# Altium schematic sheet 接口.SchDoc
size A4
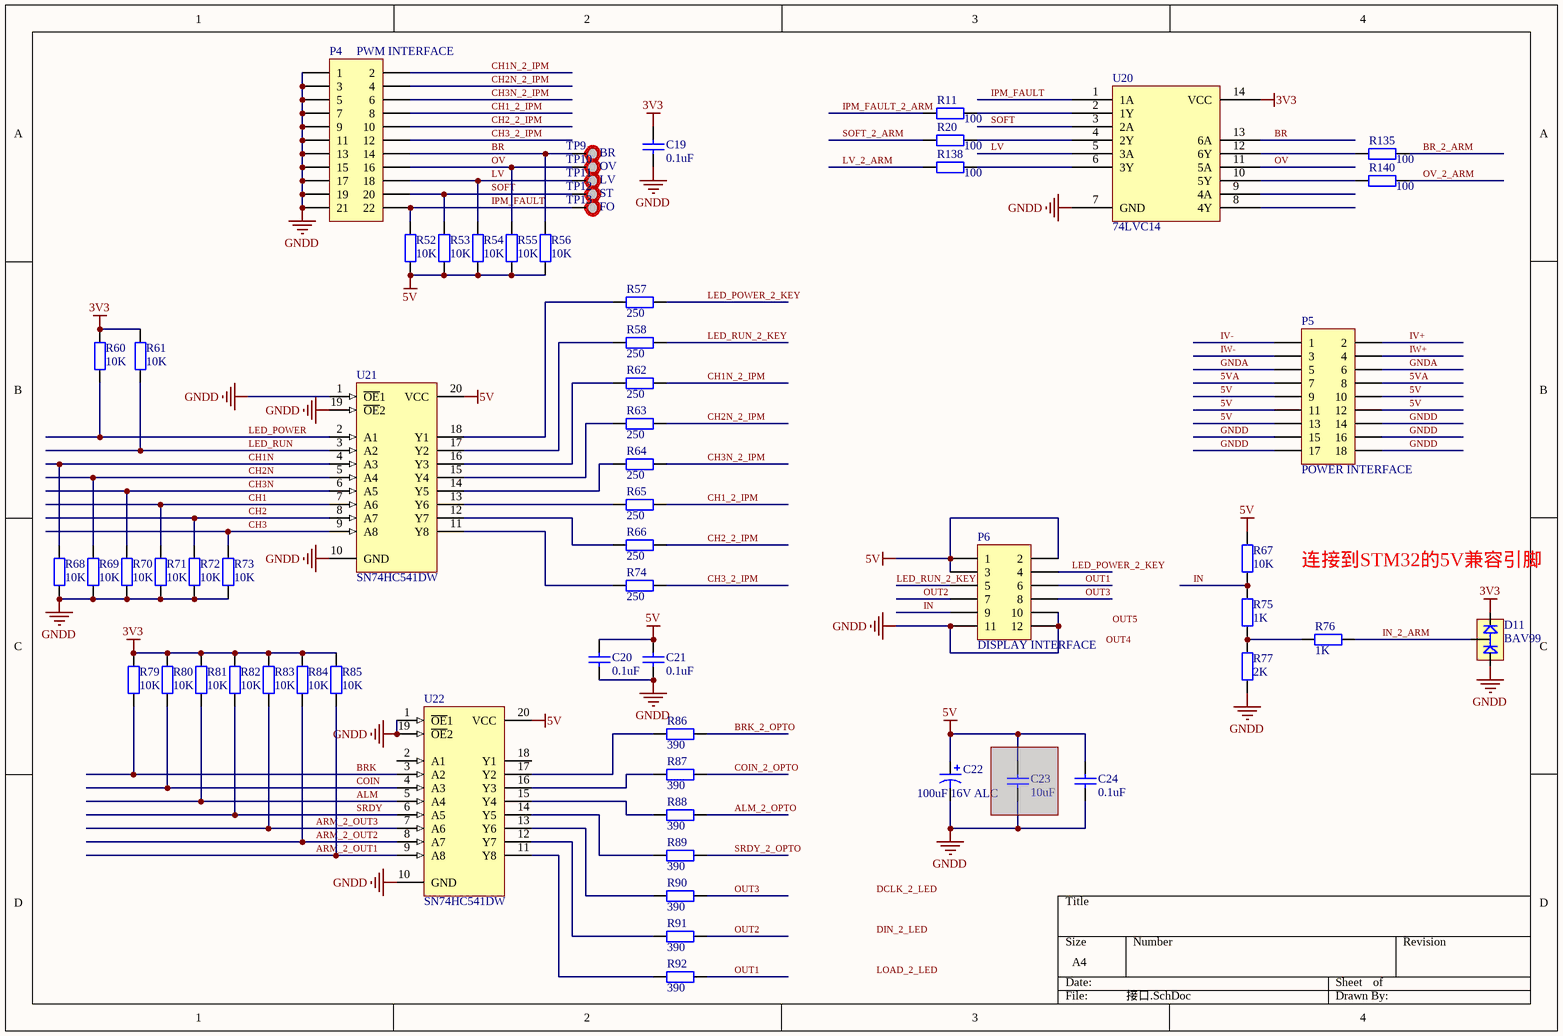
[diagram p0: 接口.SchDoc]

## Parts
C19  0.1uF  [C SMD 0603]
C20  0.1uF  [C SMD 0603]
C21  0.1uF  [C SMD 0603]
C22  100uF 16V ALC  [D6.3ALC]
C23  10uF  [C SMD 1206]  (masked out: inside a compile mask, not in the netlist)
C24  0.1uF  [C SMD 0603]
D11  BAV99  [SOT23]
P4  PWM INTERFACE  [FFC_1.0mm_22pin_弯]
P5  POWER INTERFACE  [FFC_1.0mm_18pin_弯]
P6  DISPLAY INTERFACE  [FFC_1.0mm_12pin_弯]
R11  100  [R SMD 0603]
R20  100  [R SMD 0603]
R52  10K  [R SMD 0603]
R53  10K  [R SMD 0603]
R54  10K  [R SMD 0603]
R55  10K  [R SMD 0603]
R56  10K  [R SMD 0603]
R57  250  [R SMD 0603]
R58  250  [R SMD 0603]
R60  10K  [R SMD 0603]
R61  10K  [R SMD 0603]
R62  250  [R SMD 0603]
R63  250  [R SMD 0603]
R64  250  [R SMD 0603]
R65  250  [R SMD 0603]
R66  250  [R SMD 0603]
R67  10K  [R SMD 0603]
R68  10K  [R SMD 0603]
R69  10K  [R SMD 0603]
R70  10K  [R SMD 0603]
R71  10K  [R SMD 0603]
R72  10K  [R SMD 0603]
R73  10K  [R SMD 0603]
R74  250  [R SMD 0603]
R75  1K  [R SMD 0603]
R76  1K  [R SMD 0603]
R77  2K  [R SMD 0603]
R79  10K  [R SMD 0603]
R80  10K  [R SMD 0603]
R81  10K  [R SMD 0603]
R82  10K  [R SMD 0603]
R83  10K  [R SMD 0603]
R84  10K  [R SMD 0603]
R85  10K  [R SMD 0603]
R86  390  [R SMD 0603]
R87  390  [R SMD 0603]
R88  390  [R SMD 0603]
R89  390  [R SMD 0603]
R90  390  [R SMD 0603]
R91  390  [R SMD 0603]
R92  390  [R SMD 0603]
R135  100  [R SMD 0603]
R138  100  [R SMD 0603]
R140  100  [R SMD 0603]
TP9  BR  [测点]
TP10  OV  [测点]
TP11  LV  [测点]
TP12  ST  [测点]
TP13  FO  [测点]
U20  74LVC14  [TSSOP14]
U21  SN74HC541DW  [TSSOP20]
U22  SN74HC541DW  [TSSOP20]

## Nets
3V3: C19.1 D11.2 R60.1 R61.1 R79.2 R80.2 R81.2 R82.2 R83.2 R84.2 R85.2 U20.14(VCC)
5V: C20.1 C21.1 C22.1 C24.1 P5.9 P5.10 P5.11 P5.12 P5.13 P6.1 P6.2 P6.3 R52.2 R53.2 R54.2 R55.2 R56.2 R67.1 U21.20(VCC) U22.20(VCC)
GNDD: C19.2 C20.2 C21.2 C22.2 C24.2 D11.1 P4.1 P4.3 P4.5 P4.7 P4.9 P4.11 P4.13 P4.15 P4.17 P4.19 P4.21 P5.14 P5.15 P5.16 P5.17 P5.18 P6.10 P6.11 P6.12 R68.2 R69.2 R70.2 R71.2 R72.2 R73.2 R77.1 U20.7(GND) U21.1(~{OE}1) U21.10(GND) U21.19(~{OE}2) U22.1(~{OE}1) U22.10(GND) U22.19(~{OE}2)
5VA: P5.7 P5.8
ALM: R81.1 U22.5(A4)
ALM_2_OPTO: R88.2
ARM_2_OUT1: R85.1 U22.9(A8)
ARM_2_OUT2: R84.1 U22.8(A7)
ARM_2_OUT3: R83.1 U22.7(A6)
BR: P4.14 R56.1 TP9.1 U20.13(6A)
BR_2_ARM: R135.1
BRK: R79.1 U22.3(A2)
BRK_2_OPTO: R86.2
CH1: R71.1 U21.7(A6)
CH1_2_IPM: P4.8 R65.2
CH1N: R68.1 U21.4(A3)
CH1N_2_IPM: P4.2 R62.2
CH2: R72.1 U21.8(A7)
CH2_2_IPM: P4.10 R66.2
CH2N: R69.1 U21.5(A4)
CH2N_2_IPM: P4.4 R63.2
CH3: R73.1 U21.9(A8)
CH3_2_IPM: P4.12 R74.2
CH3N: R70.1 U21.6(A5)
CH3N_2_IPM: P4.6 R64.2
COIN: R80.1 U22.4(A3)
COIN_2_OPTO: R87.2
GNDA: P5.5 P5.6
IN: P6.9 R67.2 R75.1
IN_2_ARM: D11.3 R76.1
IPM_FAULT: P4.22 R52.1 TP13.1 U20.1(1A)
IPM_FAULT_2_ARM: R11.2
IV+: P5.2
IV-: P5.1
IW+: P5.4
IW-: P5.3
LED_POWER: R60.2 U21.2(A1)
LED_POWER_2_KEY: P6.4 R57.2
LED_RUN: R61.2 U21.3(A2)
LED_RUN_2_KEY: P6.5 R58.2
LV: P4.18 R54.1 TP11.1 U20.5(3A)
LV_2_ARM: R138.2
OUT1: P6.6 R92.2
OUT2: P6.7 R91.2
OUT3: P6.8 R90.2
OV: P4.16 R55.1 TP10.1 U20.11(5A)
OV_2_ARM: R140.1
SOFT: P4.20 R53.1 TP12.1 U20.3(2A)
SOFT_2_ARM: R20.2
SRDY: R82.1 U22.6(A5)
SRDY_2_OPTO: R89.2
NetR11_1: R11.1 U20.2(1Y)
NetR20_1: R20.1 U20.4(2Y)
NetR57_1: R57.1 U21.18(Y1)
NetR58_1: R58.1 U21.17(Y2)
NetR62_1: R62.1 U21.16(Y3)
NetR63_1: R63.1 U21.15(Y4)
NetR64_1: R64.1 U21.14(Y5)
NetR65_1: R65.1 U21.13(Y6)
NetR66_1: R66.1 U21.12(Y7)
NetR74_1: R74.1 U21.11(Y8)
NetR75_2: R75.2 R76.2 R77.2
NetR86_1: R86.1 U22.17(Y2)
NetR87_1: R87.1 U22.16(Y3)
NetR88_1: R88.1 U22.15(Y4)
NetR89_1: R89.1 U22.14(Y5)
NetR90_1: R90.1 U22.13(Y6)
NetR91_1: R91.1 U22.12(Y7)
NetR92_1: R92.1 U22.11(Y8)
NetR135_2: R135.2 U20.12(6Y)
NetR138_1: R138.1 U20.6(3Y)
NetR140_2: R140.2 U20.10(5Y)

Not connected (* = marked no-connect by the designer): U20 8(4Y) 9(4A); U22 2(A1) 18(Y1)

## Notes on the sheet
- 连接到STM32的5V兼容引脚
- Labels drawn without touching a wire or pin: DCLK_2_LED, DIN_2_LED, LOAD_2_LED, OUT4, OUT5

## Library data of the parts
C19-C21 C24 = Cap: Capacitor; Published: 8-Jun-2000; LatestRevisionDate: 17-Jul-2002; LatestRevisionNote: Re-released for DXP Platform.; PackageReference: RAD-0.3; Publisher: Altium Limited; Value: 0.1uF
  C19: PackageDescription: Radial Cap, Thru-Hole; 2 Leads; 0.3 in Pin Spacing
C22 = Cap Pol1: Polarized Capacitor (Radial); Value: 100uF10VALC; Published: 8-Jun-2000; LatestRevisionDate: 17-Jul-2002; LatestRevisionNote: Re-released for DXP Platform.; PackageReference: RB7.6-15; Publisher: Altium Limited
C23 = Cap: Capacitor; Value: 0.1uF; Published: 8-Jun-2000; LatestRevisionDate: 17-Jul-2002; LatestRevisionNote: Re-released for DXP Platform.; PackageReference: RAD-0.3; Publisher: Altium Limited
P4 = Header 11X2: Header, 11-Pin, Dual row; LatestRevisionDate: 17-Jul-2002; LatestRevisionNote: Re-released for DXP Platform.; Publisher: Altium Limited
P5 = Header 9X2: Header, 9-Pin, Dual row; LatestRevisionDate: 17-Jul-2002; LatestRevisionNote: Re-released for DXP Platform.; Publisher: Altium Limited
P6 = Header 6X2: Header, 6-Pin, Dual row; LatestRevisionDate: 17-Jul-2002; LatestRevisionNote: Re-released for DXP Platform.; Publisher: Altium Limited
R11 R20 R135 R138 R140 = Res2: Resistor; Value: 3K; Published: 8-Jun-2000; LatestRevisionDate: 17-Jul-2002; LatestRevisionNote: Re-released for DXP Platform.; PackageReference: AXIAL-0.4; Publisher: Altium Limited
R52-R58 R60-R66 R68-R74 R79-R92 = Res2: Resistor; Value: 5K; Published: 8-Jun-2000; LatestRevisionDate: 17-Jul-2002; LatestRevisionNote: Re-released for DXP Platform.; PackageReference: AXIAL-0.4; Publisher: Altium Limited
R67 R75-R77 = Res2: Resistor; Value: Rx; Published: 8-Jun-2000; LatestRevisionDate: 17-Jul-2002; LatestRevisionNote: Re-released for DXP Platform.; PackageReference: AXIAL-0.4; Publisher: Altium Limited
TP9-TP13 = TEST_POINT
U21 U22 = SN74HC541DW: Octal Buffer/Driver with 3-State Outputs; Published: 8-Jun-2000; LatestRevisionDate: 13-Apr-2006; LatestRevisionNote: IPC-7351 Footprint Added.; DatasheetVersion: May-1997; PackageVersion: Mar-2000; PackageReference: DW020; Publisher: Altium Limited; PackageDescription: 20-Pin Plastic Small Outline Integrated Circuit 1.27 mm Pitch; Code_JEDEC: MS-013; Code_IPC: SOIC127P1030-20; ComponentLink1Description: Manufacturer Link; ComponentLink1URL: http://www.ti.com/; ComponentLink2Description: Datasheet; ComponentLink2URL: http://www-s.ti.com/sc/ds/sn74hc541.pdf